# EAGLE design Telefone (EAGLE 5.06)
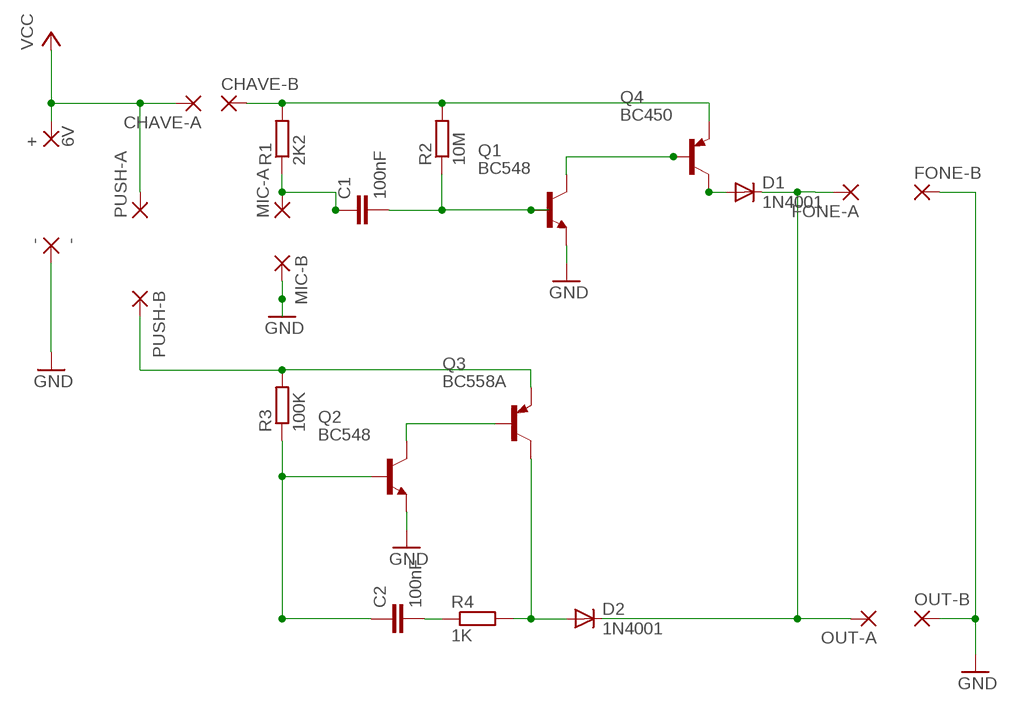
[diagram p0: schematic, sheet 1]

## Parts
+  6V  2,54/1,0  [2,54/1,0]
-  -  2,54/1,0  [2,54/1,0]
C1  100nF  C-EU025-024X044  [C025-024X044]
C2  100nF  C-EU025-024X044  [C025-024X044]
CHAVE-A  2,54/1,0  [2,54/1,0]
CHAVE-B  2,54/1,0  [2,54/1,0]
D1  1N4001  DIODE-DO34-7  [DO34-7]
D2  1N4001  DIODE-DO34-7  [DO34-7]
FONE-A  2,54/1,0  [2,54/1,0]
FONE-B  2,54/1,0  [2,54/1,0]
MIC-A  2,54/1,0  [2,54/1,0]
MIC-B  2,54/1,0  [2,54/1,0]
OUT-A  2,54/1,0  [2,54/1,0]
OUT-B  2,54/1,0  [2,54/1,0]
PUSH-A  2,54/1,0  [2,54/1,0]
PUSH-B  2,54/1,0  [2,54/1,0]
Q1  BC548  [TO92-EBC]
Q2  BC548  [TO92-EBC]
Q3  BC558A  [TO92-EBC]
Q4  BC450  [TO92-EBC]
R1  2K2  R-EU_0204/7  [0204/7]
R2  10M  R-EU_0204/7  [0204/7]
R3  100K  R-EU_0204/7  [0204/7]
R4  1K  R-EU_0204/7  [0204/7]

## Nets
GND: -.1(P) FONE-B.1(P) MIC-B.1(P) OUT-B.1(P) Q1.E Q2.E
N$1: D1.A Q4.C
N$2: PUSH-B.1(P) Q3.E R3.2
N$3: CHAVE-B.1(P) Q4.E R1.2 R2.2
N$4: C1.1 MIC-A.1(P) R1.1
N$6: C1.2 Q1.B R2.1
N$8: C2.1 Q2.B R3.1
N$9: Q2.C Q3.B
N$10: Q1.C Q4.B
N$11: C2.2 R4.1
N$12: D2.A Q3.C R4.2
N$13: D1.C D2.C FONE-A.1(P) OUT-A.1(P)
VCC: +.1(P) CHAVE-A.1(P) PUSH-A.1(P)

## Library data of the parts
+ - CHAVE-A CHAVE-B FONE-A FONE-B MIC-A MIC-B OUT-A OUT-B PUSH-A PUSH-B = wirepad:2,54/1,0: THROUGH-HOLE PAD
C1 C2 = rcl:C-EU: CAPACITOR, European symbol
D1 D2 = diode:DIODE-: DIODE
Q1 Q2 = transistor-npn:BC548*: NPN Transistor
Q3 = transistor-pnp:BC558*: PNP Transistror
Q4 = transistor-pnp:BC450*: PNP Transistror
R1-R4 = rcl:R-EU_: RESISTOR, European symbol

## Board
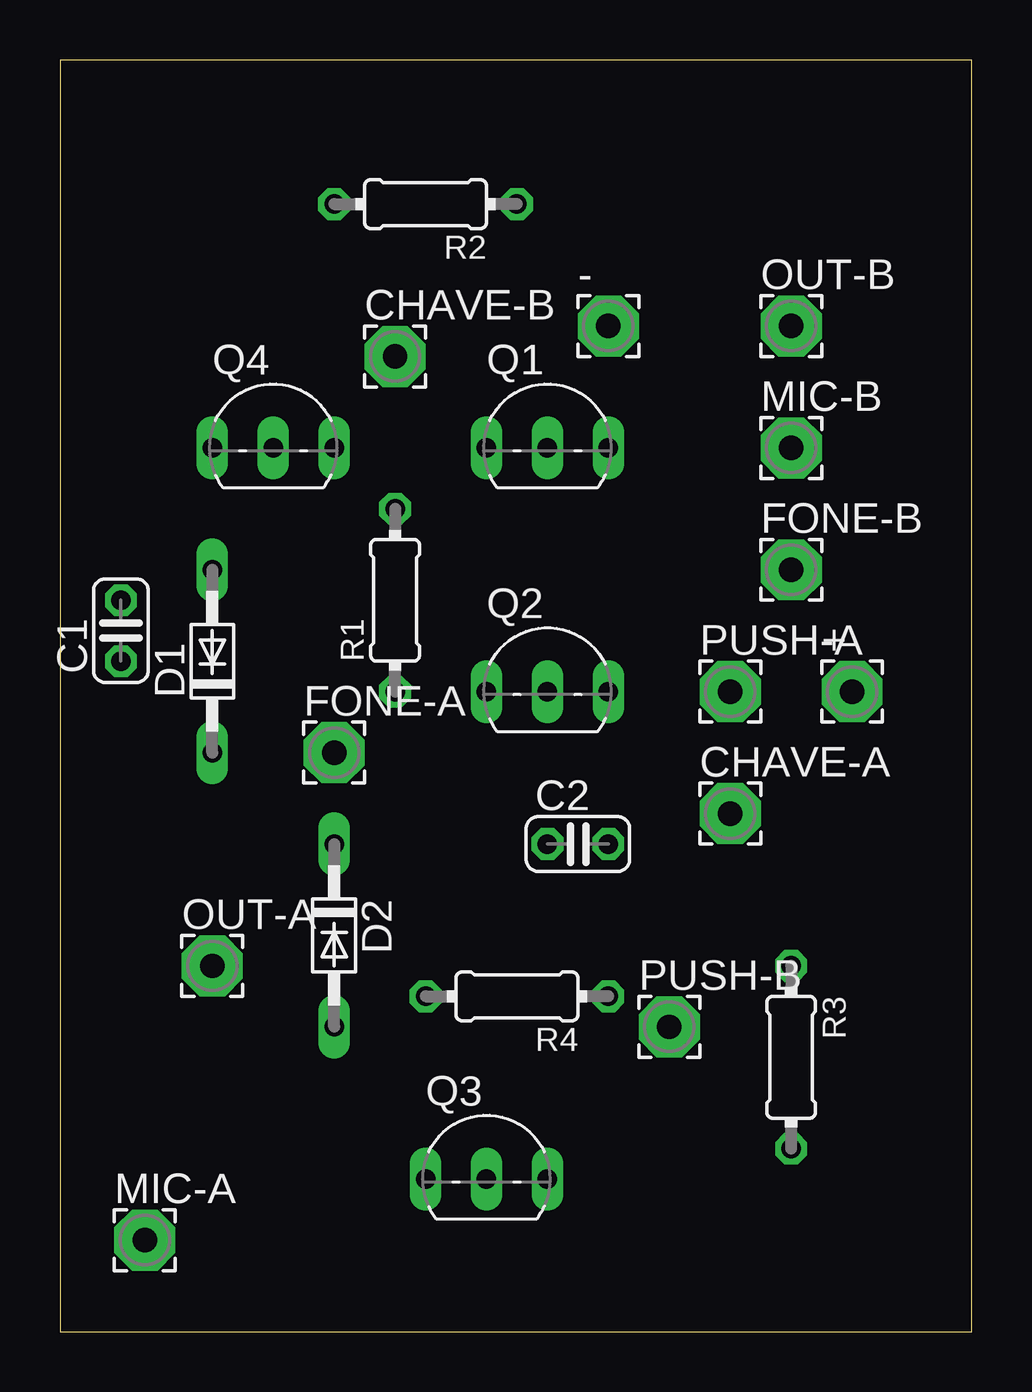
[diagram p1: board, top side]
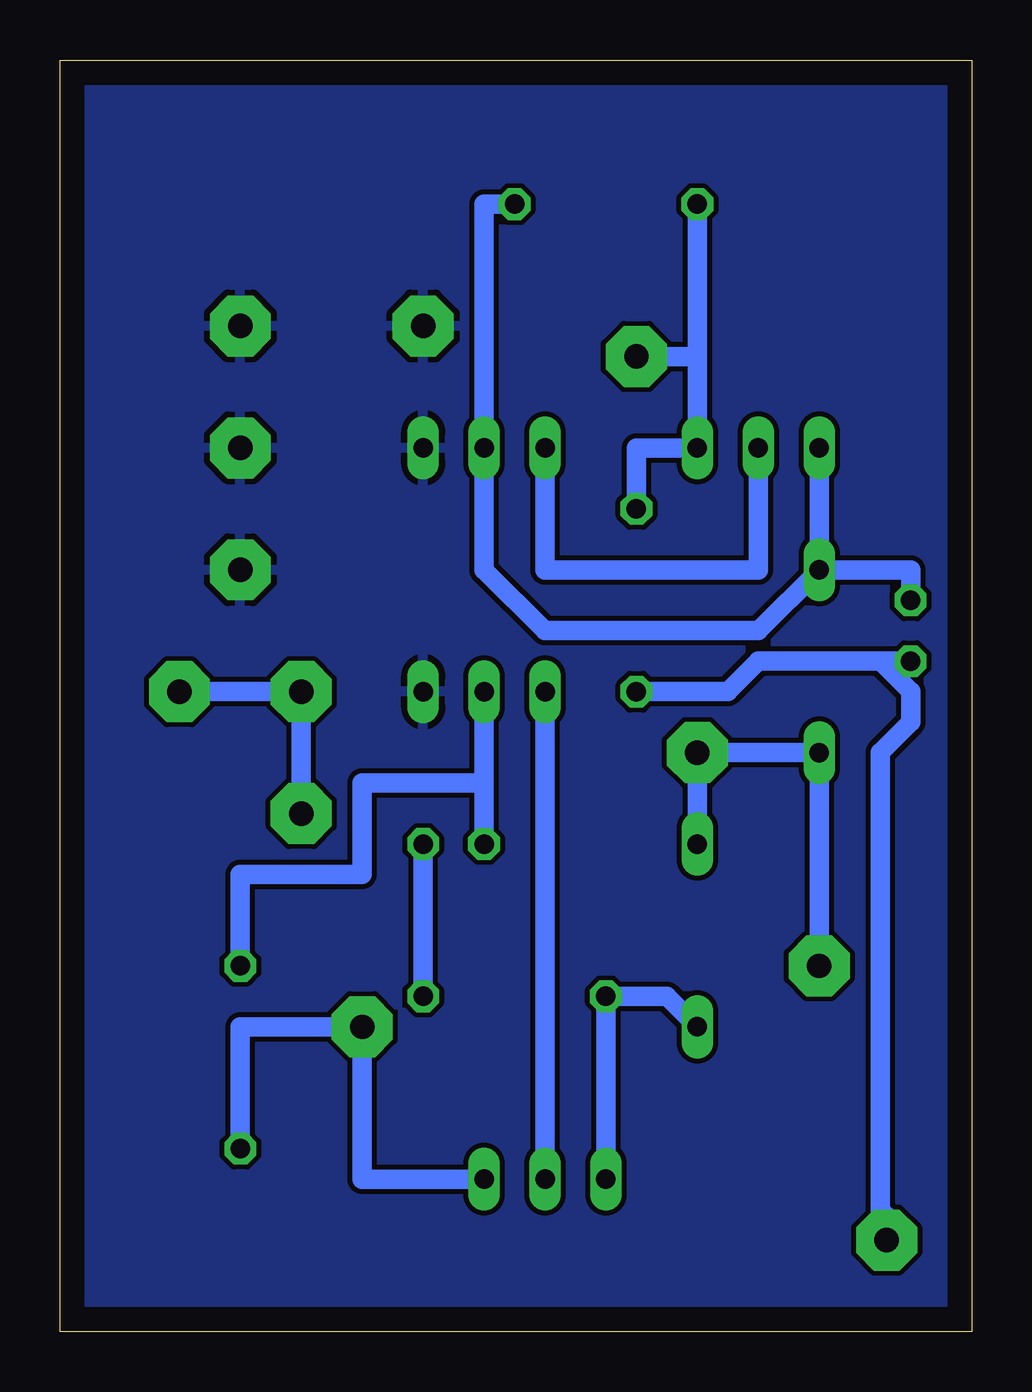
[diagram p2: board, bottom side, seen from below]

Size 38 x 53 mm. Coordinates in mm from the lower left corner, seen from the top.
Outline: 0,0 38,0 38,53 0,53 0,0
Copper layers (1*16): Top 0.035mm / dielectric 1.5mm / Bottom 0.035mm
Design rules "default *": minimum track width 38mil, minimum drill 24mil, track to track 8mil, track to pad 8mil, pad to pad 8mil, via to via 8mil, smd to smd 8mil, copper to edge 40mil, drill to drill 8mil, minimum pad ring 10mil, minimum via ring 8mil, stop-mask expansion 4mil, vias tented up to drill 0mil, thermal gap 10mil

### Footprints (pad centres in the part's own frame; a part is rotated, then mirrored left to right if it is on the bottom)
2,54/1,0 = drill 1.016 pad 2.54 octagon: 1 0,0
C025-024X044 = drill 0.813 octagon: 1 -1.27,0; 2 1.27,0
DO34-7 = drill 0.813 long: A 3.81,0; C -3.81,0
TO92-EBC = drill 0.813 long: B 0,-1.27; C -2.54,-1.27; E 2.54,-1.27
0204/7 = drill 0.813 octagon: 1 -3.81,0; 2 3.81,0

### Placement (x,y rotation side)
+  33.02,26.67 0 top
-  22.86,41.91 0 top
C1  2.54,29.21 90 top
C2  21.59,20.32 0 top
CHAVE-A  27.94,21.59 0 top
CHAVE-B  13.97,40.64 0 top
D1  6.35,27.94 90 top
D2  11.43,16.51 270 top
FONE-A  11.43,24.13 0 top
FONE-B  30.48,31.75 0 top
MIC-A  3.54,3.81 0 top
MIC-B  30.48,36.83 0 top
OUT-A  6.35,15.24 0 top
OUT-B  30.48,41.91 0 top
PUSH-A  27.94,26.67 0 top
PUSH-B  25.4,12.7 0 top
Q1  20.32,38.1 0 top
Q2  20.32,27.94 0 top
Q3  17.78,7.62 0 top
Q4  8.89,38.1 0 top
R1  13.97,30.48 90 top
R2  15.24,46.99 180 top
R3  30.48,11.43 270 top
R4  19.05,13.97 180 top

### Tracks (layer width: path | path; a pad name or v marks a point on that pad's centre or on a via)
GND
  pour Bottom: 1,52 37,52 37,51 37,1 1,1
N$1
  Bottom 0.813: D1.A Q4.C
N$2
  Bottom 0.813: R3.2 30.48,12.7 PUSH-B.1 25.4,6.35 Q3.E
N$3
  Bottom 0.813: 11.43,40.64 R2.2 | 11.43,40.64 CHAVE-B.1 | 11.43,40.64 Q4.E 13.97,36.83 R1.2
N$4
  Bottom 0.813: 3.81,27.94 C1.1 | R1.1 10.16,26.67 8.89,27.94 3.81,27.94 | 3.81,27.94 2.54,26.67 2.54,25.4 3.81,24.13 3.81,5.08 3.54,4.81 MIC-A.1
N$6
  Bottom 0.813: R2.1 20.32,46.99 Q1.B 20.32,31.75 17.78,29.21 8.89,29.21 6.35,31.75 2.54,31.75 C1.2
N$8
  Bottom 0.813: 20.32,22.86 Q2.B | C2.1 20.32,22.86 | 20.32,22.86 25.4,22.86 25.4,19.05 30.48,19.05 R3.1
N$9
  Bottom 0.813: Q3.B Q2.C
N$10
  Bottom 0.813: Q4.B 8.89,31.75 17.78,31.75 Q1.C
N$11
  Bottom 0.813: R4.1 C2.2
N$12
  Bottom 0.813: D2.A 12.7,13.97 R4.2 Q3.C
N$13
  Bottom 0.813: D2.C FONE-A.1 D1.C OUT-A.1
VCC
  Bottom 0.813: +.1 PUSH-A.1 CHAVE-A.1